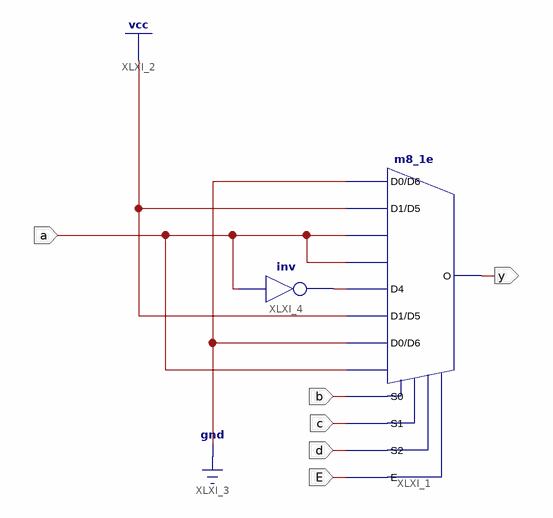
[diagram p0: schematic sheet 1]
// Xilinx ISE schematic ukol4.sch (spartan3) as structural Verilog: 2 symbols, 6 ports
module ukol4 (
  input  E,
  input  b,
  input  c,
  input  d,
  input  a,
  output y
);

  wire XLXN_21;

  m8_1e XLXI_1 (
    .D0(1'b0), .D1(1'b1), .D2(a), .D3(a), .D4(XLXN_21), .D5(1'b1), .D6(1'b0), .D7(a), .E(E), .S0(b), .S1(c),
    .S2(d), .O(y));
  not XLXI_4 (XLXN_21, a);
endmodule
